# EAGLE design htu20df (EAGLE 8.5.0)
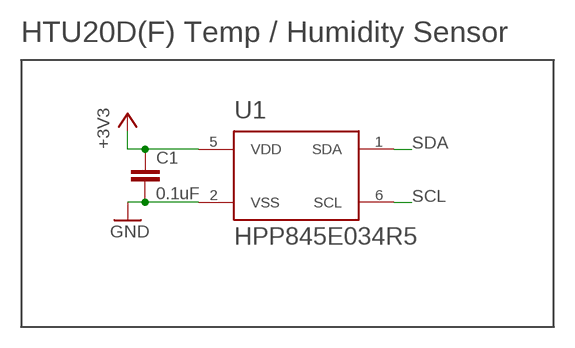
[diagram p0: schematic, sheet 1]

## Parts
C1  0.1uF  0.1UF-C0603C104K5RACTU  [C0603]
U1  HPP845E034R5  [HTU20D(F)]

## Nets
+3V3: C1.1 U1.5(VDD)
GND: C1.2 U1.2(VSS)
SCL: U1.6(SCL)
SDA: U1.1(SDA)

## Notes on the sheet
- HTU20D(F) Temp / Humidity Sensor

## Library data of the parts
C1 = openag-capacitors:0.1UF-C0603C104K5RACTU: Kemet - C0603C104K5RACTU - CAP CER 0.1UF 50V X7R 0603 Description: 0.1µF ±10% 50V Ceramic Capacitor X7R 0603 (1608 Metric) Technical Specifications: Capacitance: 0.1µF Tolerance: ±10% Rated Voltage: 50V Temperature Coefficient: X7R Operating Temperature: -55°C ~ 125°C Package / Case: 0603 (1608 Metric) Datasheet(s): X7R Dielectric, 6.3-250 VDC <https://search.kemet.com/component-edge/download/datasheet/C0603C104K5RACTU.pdf> Vendor(s): Digikey: 399-5089-1-ND <https://www.digikey.com/product-detail/en/kemet/C0603C104K5RACTU/399-5089-1-ND/1465623>; POPULATE: YES; VERIFIED: NO
U1 = openag-sensors:HPP845E034R5: TE Connectivity Measurement Specialties - HPP845E034R5 - SENSOR HUMID/TEMP 3V I2C 3% SMD Description: Humidity Temperature Sensor 0 ~ 100% RH I²C ±5% RH 5s Surface Mount Technical Specifications: Sensor Type: Humidity, Temperature Humidity Range: 0 ~ 100% RH Output Type: I²C Output: 12b Accuracy: ±5% RH Response Time: 5s Voltage - Supply: 1.5 V ~ 3.6 V Mounting Type: Surface Mount Operating Temperature: -40°C ~ 125°C Datasheet(s): HTU20D(F) Series (HPP845E034Rx) Datasheet <http://www.te.com/commerce/DocumentDelivery/DDEController?Action=srchrtrv&DocNm=HPC202_5&DocType=Data+Sheet&DocLang=English> Vendor(s): Digikey: 223-1592-1-ND <https://www.digikey.com/product-detail/en/te-connectivity-measurement-specialties/HPP845E034R5/223-1592-1-ND/5416096>; POPULATE: YES; VERIFIED: NO

## Board
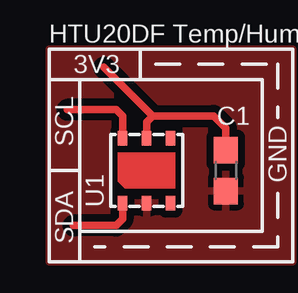
[diagram p1: board, top side]

No outline drawn. Coordinates in mm, seen from the top.
Copper layers (1*16): Top 0.035559375mm / dielectric 1.6mm / Bottom 0.035559375mm
Design rules "oshpark-2layer *": minimum track width 6mil, minimum drill 10mil, track to track 6mil, track to pad 6mil, pad to pad 6mil, via to via 6mil, smd to smd 6mil, copper to edge 15mil, drill to drill 6mil, minimum pad ring 5mil, minimum via ring 5mil, stop-mask expansion 2.5mil, vias tented up to drill 20mil, thermal gap 10mil

### Footprints (pad centres in the part's own frame; a part is rotated, then mirrored left to right if it is on the bottom)
C0603 = smd 1.1 x 1: 1 -0.85,0; 2 0.85,0
HTU20D(F) = smd 0.4 x 0.6: 1 -1,-1.35; 2 0,-1.35; 3 1,-1.35; 4 1,1.35; 5 0,1.35; 6 -1,1.35

### Placement (x,y rotation side)
C1  7.37,3.81 270 top
U1  4.06,3.81 0 top

### Tracks (layer width: path | path; a pad name or v marks a point on that pad's centre or on a via)
+3V3
  Top 0.305: C1.1 7.37,5.59 6.86,6.1 4.32,6.1 | U1.5 4.06,5.84 4.32,6.1 | 4.32,6.1 2.29,8.13
GND
  pour Top (isolate 0.305): 0,0 10.16,0 10.16,8.89 0,8.89
SCL
  Top 0.305: U1.6 3.06,6.08 2.79,6.35 0.76,6.35
SDA
  Top 0.305: U1.1 3.06,1.79 2.79,1.52 1.02,1.52

### Text on the board
tPlace: HTU20DF Temp/Hum | 3V3 | SCL | GND | SDA